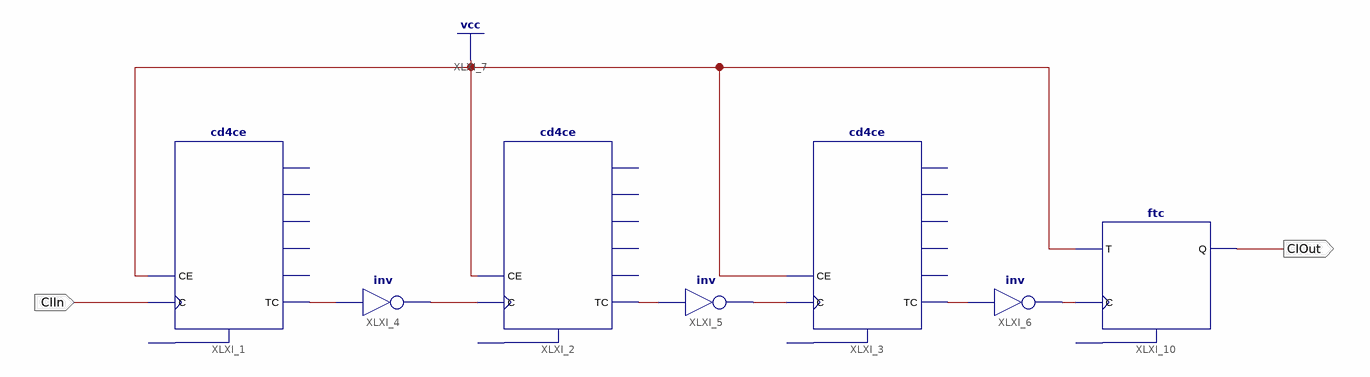
[diagram p0: schematic sheet 1]
// Xilinx ISE schematic DivideClk.sch (spartan6) as structural Verilog: 7 symbols, 2 ports
module DivideClk (
  input  ClIn,
  output ClOut
);

  wire XLXN_1, XLXN_2, XLXN_3, XLXN_4, XLXN_8, XLXN_11;

  cd4ce XLXI_1 (.C(ClIn), .CE(1'b1), .TC(XLXN_1));  // open: CLR, CEO, Q0, Q1, Q2, Q3
  cd4ce XLXI_2 (.C(XLXN_2), .CE(1'b1), .TC(XLXN_3));  // open: CLR, CEO, Q0, Q1, Q2, Q3
  cd4ce XLXI_3 (.C(XLXN_4), .CE(1'b1), .TC(XLXN_8));  // open: CLR, CEO, Q0, Q1, Q2, Q3
  not XLXI_4 (XLXN_2, XLXN_1);
  not XLXI_5 (XLXN_4, XLXN_3);
  not XLXI_6 (XLXN_11, XLXN_8);
  ftc XLXI_10 (.C(XLXN_11), .T(1'b1), .Q(ClOut));  // open: CLR
endmodule
